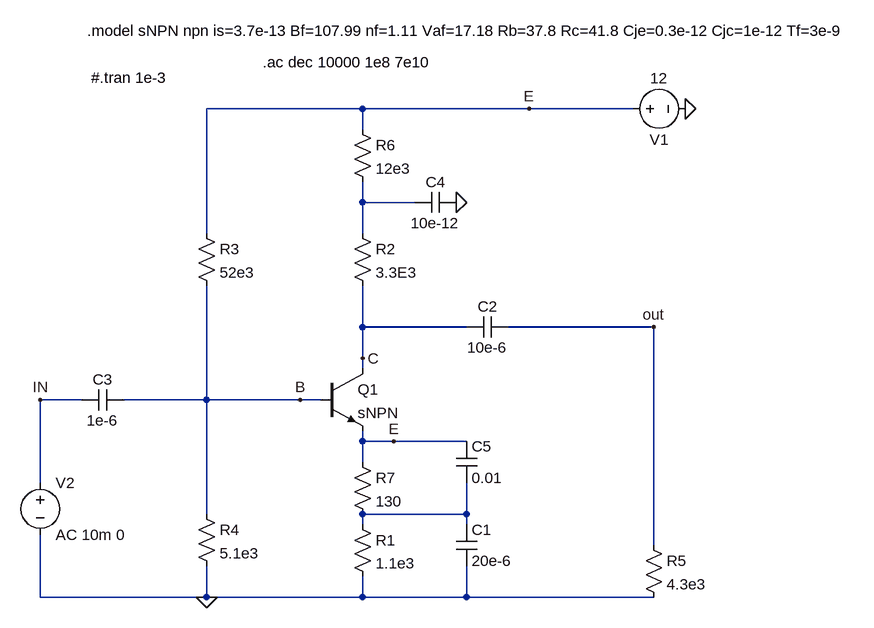
[diagram p0: schematic Draft2.asc]
Draft2.asc, the LTspice schematic file:
Version 4
SHEET 1 912 808
WIRE 48 16 -192 16
WIRE 304 16 48 16
WIRE 464 16 304 16
WIRE 48 48 48 16
WIRE 48 160 48 128
WIRE 128 160 48 160
WIRE -192 208 -192 16
WIRE 48 208 48 160
WIRE 48 352 48 288
WIRE 208 352 48 352
WIRE 496 352 272 352
WIRE 48 400 48 352
WIRE 48 416 48 400
WIRE -384 464 -448 464
WIRE -192 464 -192 288
WIRE -192 464 -320 464
WIRE -48 464 -192 464
WIRE -16 464 -48 464
WIRE 48 528 48 512
WIRE 96 528 48 528
WIRE 208 528 96 528
WIRE 48 560 48 528
WIRE -448 592 -448 464
WIRE -192 640 -192 464
WIRE 208 640 208 592
WIRE 208 640 48 640
WIRE 48 656 48 640
WIRE 208 656 208 640
WIRE 496 688 496 352
WIRE -448 768 -448 672
WIRE -192 768 -192 720
WIRE -192 768 -448 768
WIRE 48 768 48 736
WIRE 48 768 -192 768
WIRE 208 768 208 720
WIRE 208 768 48 768
WIRE 496 768 208 768
FLAG 544 16 0
FLAG -192 768 0
FLAG -448 464 IN
FLAG 496 352 out
FLAG 304 16 E
FLAG 192 160 0
FLAG -48 464 B
FLAG 48 400 C
FLAG 96 528 E
SYMBOL npn -16 416 R0
SYMATTR InstName Q1
SYMATTR Value sNPN
SYMBOL res 32 640 R0
SYMATTR InstName R1
SYMATTR Value 1.1e3
SYMBOL res 32 192 R0
SYMATTR InstName R2
SYMATTR Value 3.3E3
SYMBOL res -208 192 R0
SYMATTR InstName R3
SYMATTR Value 52e3
SYMBOL res -208 624 R0
SYMATTR InstName R4
SYMATTR Value 5.1e3
SYMBOL res 480 672 R0
SYMATTR InstName R5
SYMATTR Value 4.3e3
SYMBOL cap 192 656 R0
SYMATTR InstName C1
SYMATTR Value 20e-6
SYMBOL cap 272 336 R90
WINDOW 0 0 32 VBottom 2
WINDOW 3 32 32 VTop 2
SYMATTR InstName C2
SYMATTR Value 10e-6
SYMBOL cap -320 448 R90
WINDOW 0 0 32 VBottom 2
WINDOW 3 32 32 VTop 2
SYMATTR InstName C3
SYMATTR Value 1e-6
SYMBOL voltage 448 16 R270
WINDOW 0 -32 56 VBottom 2
WINDOW 3 32 56 VTop 2
WINDOW 123 0 0 Left 0
WINDOW 39 0 0 Left 0
SYMATTR InstName V1
SYMATTR Value 12
SYMBOL voltage -448 576 R0
WINDOW 123 0 0 Left 0
WINDOW 39 0 0 Left 0
SYMATTR InstName V2
SYMATTR Value AC 10m 0
SYMBOL res 32 32 R0
SYMATTR InstName R6
SYMATTR Value 12e3
SYMBOL cap 192 144 R90
WINDOW 0 0 32 VBottom 2
WINDOW 3 32 32 VTop 2
SYMATTR InstName C4
SYMATTR Value 10e-12
SYMBOL res 32 544 R0
SYMATTR InstName R7
SYMATTR Value 130
SYMBOL cap 192 528 R0
SYMATTR InstName C5
SYMATTR Value 0.01
TEXT -376 -104 Left 2 !.model sNPN npn is=3.7e-13 Bf=107.99 nf=1.11 Vaf=17.18 Rb=37.8 Rc=41.8 Cje=0.3e-12 Cjc=1e-12 Tf=3e-9
TEXT -370 -32 Left 2 !#.tran 1e-3
TEXT -106 -56 Left 2 !.ac dec 10000 1e8 7e10

The netlist it stands for:
* Draft2.asc
Q1 C B E 0 sNPN
R1 N002 0 1.1e3
R2 N001 C 3.3E3
R3 E B 52e3
R4 B 0 5.1e3
R5 out 0 4.3e3
C1 N002 0 20e-6
C2 out C 10e-6
C3 B IN 1e-6
V1 E 0 12
V2 IN 0 AC 10m 0
R6 E N001 12e3
C4 0 N001 10e-12
R7 E N002 130
C5 E N002 0.01
.model NPN NPN
.model PNP PNP
.lib standard.bjt
.model sNPN npn is=3.7e-13 Bf=107.99 nf=1.11 Vaf=17.18 Rb=37.8 Rc=41.8 Cje=0.3e-12 Cjc=1e-12 Tf=3e-9
#.tran 1e-3
.ac dec 10000 1e8 7e10
.backanno
.end